# Altium schematic sheet PowerInput.SchDoc
size A4; SheetNumber: 2; SheetTotal: 7
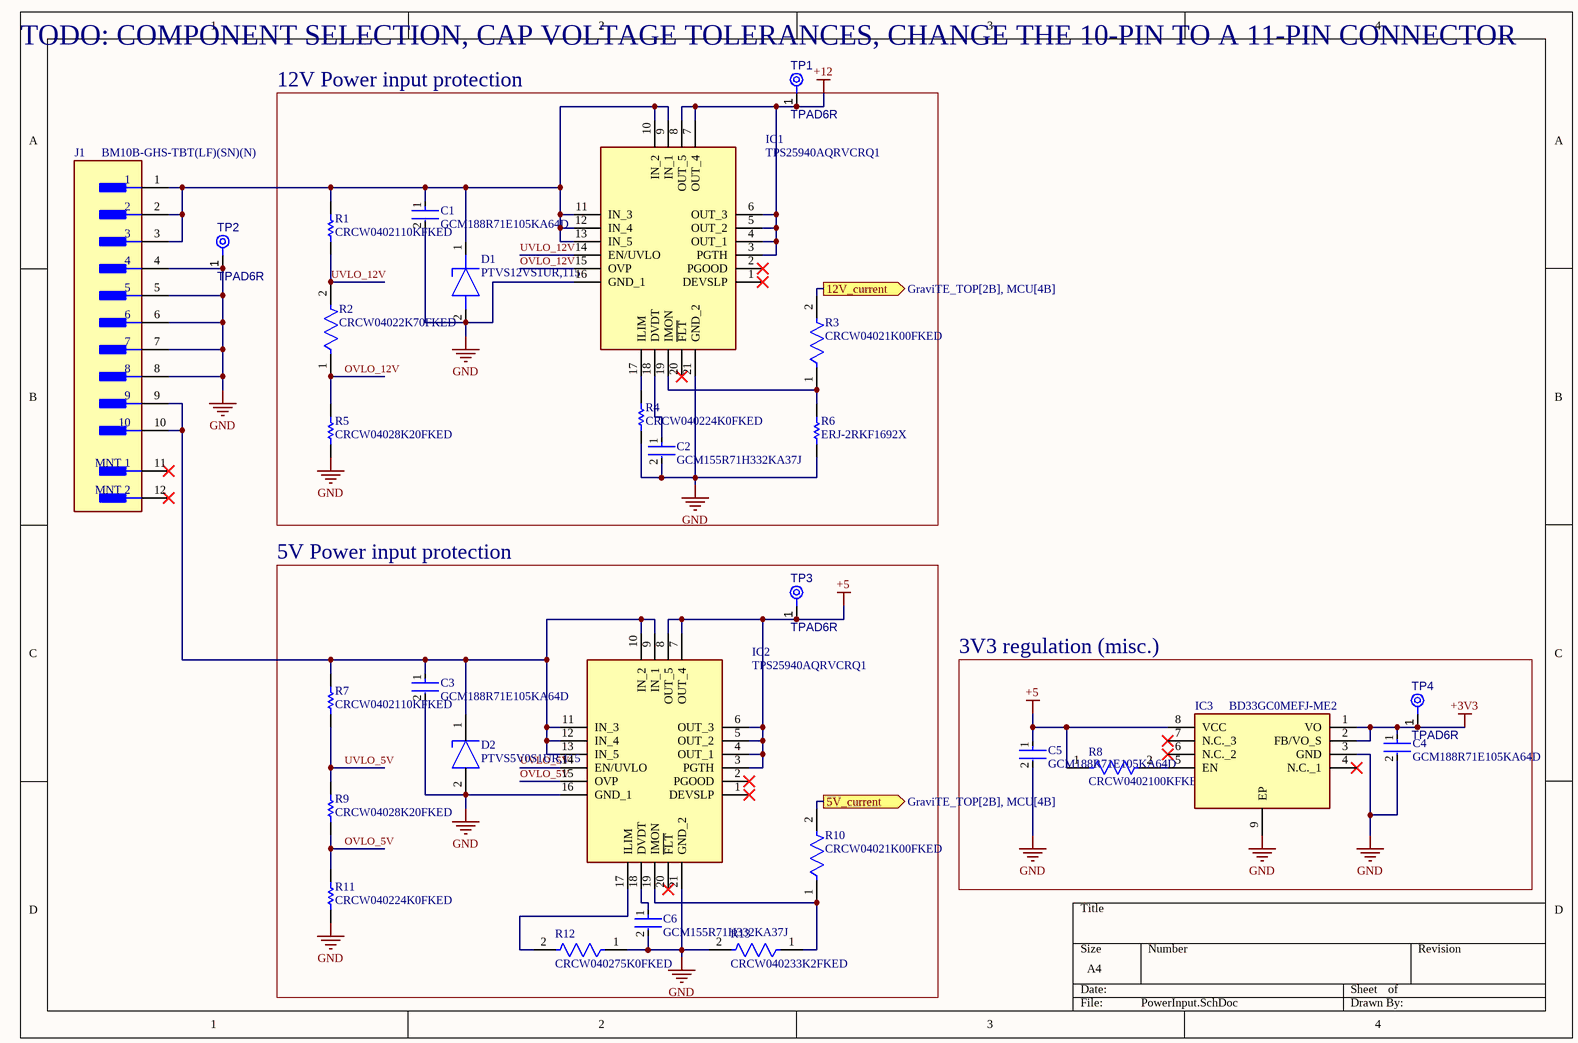
[diagram p0: PowerInput.SchDoc]

## Parts
C1  GCM188R71E105KA64D  [FP-GCM188-0_1-MFG]
C2  GCM155R71H332KA37J  [FP-GCM155-0_05-MFG]
C3  GCM188R71E105KA64D  [FP-GCM188-0_1-MFG]
C4  GCM188R71E105KA64D  [FP-GCM188-0_1-MFG]
C5  GCM188R71E105KA64D  [FP-GCM188-0_1-MFG]
C6  GCM155R71H332KA37J  [FP-GCM155-0_05-MFG]
D1  PTVS12VS1UR,115  [SOD123W]
D2  PTVS5V0S1UR,115  [FP-SOD123W-MFG]
IC1  TPS25940AQRVCRQ1  [QFN50P300X400X80-21N]
IC2  TPS25940AQRVCRQ1  [QFN50P300X400X80-21N]
IC3  BD33GC0MEFJ-ME2  [SOIC127P600X100-9N]
J1  BM10B-GHS-TBT(LF)(SN)(N)  [FP-BM10B-GHS-TBT_LF_SN-MFG]
R1  CRCW0402110KFKED  [RESC1005X40X25NL05T05]
R2  CRCW04022K70FKED  [FP-CRCW0402-e3-IPC_A]
R3  CRCW04021K00FKED  [FP-CRCW0402-e3-MFG]
R4  CRCW040224K0FKED  [RESC1005X40X25ML05T05]
R5  CRCW04028K20FKED  [RESC1005X40X25ML05T05]
R6  ERJ-2RKF1692X  [RESC1005X40X25ML05T05]
R7  CRCW0402110KFKED  [RESC1005X40X25NL05T05]
R8  CRCW0402100KFKED  [FP-CRCW0402-e3-IPC_C]
R9  CRCW04028K20FKED  [RESC1005X40X25ML05T05]
R10  CRCW04021K00FKED  [FP-CRCW0402-e3-MFG]
R11  CRCW040224K0FKED  [RESC1005X40X25ML05T05]
R12  CRCW040275K0FKED  [FP-CRCW0402-e3-IPC_A]
R13  CRCW040233K2FKED  [Vishay_CRCW0402-e3_MFG]
TP1  TPAD6R  [TP06R]  (no BOM)
TP2  TPAD6R  [TP06R]  (no BOM)
TP3  TPAD6R  [TP06R]  (no BOM)
TP4  TPAD6R  [TP06R]  (no BOM)

## Blocks framed on the sheet
12V Power input protection: C1 C2 D1 IC1 R1-R6
5V Power input protection: C3 C6 D2 IC2 R7 R9-R13 TP3
3V3 regulation (misc.): C4 C5 IC3 R8 TP4

## Ports
5V_current (out, see GraviTE_TOP[2B], MCU[4B]), 12V_current (out, see GraviTE_TOP[2B], MCU[4B])

## Nets
+3V3: C4.1 IC3.1(VO) IC3.2(FB/VO_S) TP4.1(TP)
+5: C5.1 IC2.3(PGTH) IC2.4(OUT_1) IC2.5(OUT_2) IC2.6(OUT_3) IC2.7(OUT_4) IC2.8(OUT_5) IC3.8(VCC) R8.1 TP3.1(TP)
+12: IC1.3(PGTH) IC1.4(OUT_1) IC1.5(OUT_2) IC1.6(OUT_3) IC1.7(OUT_4) IC1.8(OUT_5) TP1.1(TP)
GND: C1.2 C2.2 C3.2 C4.2 C5.2 C6.2 D1.2(A) D2.2(A) IC1.16(GND_1) IC1.21(GND_2) IC2.16(GND_1) IC2.21(GND_2) IC3.3(GND) IC3.9(EP) J1.4 J1.5 J1.6 J1.7 J1.8 R4.1 R5.1 R6.1 R11.1 R12.1 R13.2 TP2.1(TP)
5V_current: R10.2 ; port 5V_current
12V_current: R3.2 ; port 12V_current
OVLO_5V: IC2.15(OVP) R9.1 R11.2
OVLO_12V: IC1.15(OVP) R2.1 R5.2
UVLO_5V: IC2.14(EN/UVLO) R7.1 R9.2
UVLO_12V: IC1.14(EN/UVLO) R1.1 R2.2
NetC1_1: C1.1 D1.1(K) IC1.9(IN_1) IC1.10(IN_2) IC1.11(IN_3) IC1.12(IN_4) IC1.13(IN_5) J1.1 J1.2 J1.3 R1.2
NetC2_1: C2.1 IC1.18(DVDT)
NetC3_1: C3.1 D2.1(C) IC2.9(IN_1) IC2.10(IN_2) IC2.11(IN_3) IC2.12(IN_4) IC2.13(IN_5) J1.9 J1.10 R7.2
NetC6_1: C6.1 IC2.18(DVDT)
NetIC1_17: IC1.17(ILIM) R4.2
NetIC1_19: IC1.19(IMON) R3.1 R6.2
NetIC2_17: IC2.17(ILIM) R12.2
NetIC2_19: IC2.19(IMON) R10.1 R13.1
NetIC3_5: IC3.5(EN) R8.2

Not connected (* = marked no-connect by the designer): IC1 1(DEVSLP)* 2(PGOOD)* 20(~{FLT})*; IC2 1(DEVSLP)* 2(PGOOD)* 20(~{FLT})*; IC3 4(N.C._1)* 6(N.C._2)* 7(N.C._3)*; J1 11(MNT_1)* 12(MNT_2)*

## Notes on the sheet
- (near TP1) TODO: COMPONENT SELECTION, CAP VOLTAGE TOLERANCES, CHANGE THE 10-PIN TO A 11-PIN CONNECTOR

## Library data of the parts
C1 C3-C5 = CMP-2006-02363-4: Manufacturer Lifecycle Status: IN PRODUCTION; NexarPartId: 18909256; Dielectric: X7R; Material: Ceramic; Tolerance: 10%; Capacitance: 1µF; Voltage Rating: 25V; Thickness: 889µm; Max Operating Temperature: 125°C; Radiation Hardening: No; Weight: 6.293594mg; Lead Free: Lead Free; Mount: Surface Mount; Case Code (Imperial): 0603; REACH SVHC: No SVHC; Lifecycle Status: Production; Depth: 800µm; Min Operating Temperature: -55°C; Height: 800µm; Case Code (Metric): 1608; Case/Package: 0603; Voltage: 25V; Packaging: Cut Tape; Length: 1.6mm; Termination: SMD/SMT; Width: 787.4µm; Voltage Rating (DC): 25V; RoHS: Compliant; Schedule B: 8532240020, 8532240020; Ratings: AEC-Q200
C2 C6 = CMP-06035-006656-1: Ceramic Capacitor for Automotive 3.3nF ±10% 50VDC X7R 0402 Paper T/R; Voltage Rating (DC): 50V; Max Operating Temperature: 125°C; Termination: SMD/SMT; Depth: 0.5mm; Min Operating Temperature: -55°C; Voltage Rating: 50V; Length: 1mm; Radiation Hardening: No; Tolerance: 10%; Case Code (Imperial): 0402; Mount: Surface Mount; Package Quantity: 50000; Width: 0.5mm; Height: 0.5mm; Case Code (Metric): 1005; Capacitance: 3.3nF; Packaging: Tape and Reel; Case/Package: 0402; Dielectric: X7R
D1 = PTVS12VS1UR,115: Diode ESD (Uni-directional); Manufacturer_Name: Nexperia; Datasheet Link: https://assets.nexperia.com/documents/data-sheet/PTVSXS1UR_SER.pdf; Manufacturer_Part_Number: PTVS12VS1UR,115; Mouser Part Number: 771-PTVS12VS1UR115; Mouser Price/Stock: https://www.mouser.co.uk/ProductDetail/Nexperia/PTVS12VS1UR115?qs=LMSg3oBIm%2FiWSHvsyxWiLg%3D%3D; Arrow Part Number: PTVS12VS1UR,115; Arrow Price/Stock: https://www.arrow.com/en/products/ptvs12vs1ur115/nexperia?region=nac
D2 = CMP-14436-000018-1: TVS DIODE 5VWM 9.2VC CFP3; RoHS Compliant: Yes
IC1 IC2 = TPS25940AQRVCRQ1: Integrated Circuit; Manufacturer_Name: Texas Instruments; Datasheet Link: http://www.ti.com/lit/gpn/tps25940-q1; Height: 0.8mm; Manufacturer_Part_Number: TPS25940AQRVCRQ1; Mouser Part Number: 595-TPS25940AQRVCRQ1; Mouser Price/Stock: https://www.mouser.co.uk/ProductDetail/Texas-Instruments/TPS25940AQRVCRQ1?qs=osPbIpHqQ9Uam0Tf4VM8lQ%3D%3D; Arrow Part Number: TPS25940AQRVCRQ1; Arrow Price/Stock: https://www.arrow.com/en/products/tps25940aqrvcrq1/texas-instruments
IC3 = BD33GC0MEFJ-ME2: Integrated Circuit; Manufacturer_Name: ROHM Semiconductor; Datasheet Link: https://www.mouser.cl/datasheet/2/348/bdxxgc0mefj-m-e-1874062.pdf; Height: 1mm; Manufacturer_Part_Number: BD33GC0MEFJ-ME2; Mouser Part Number: 755-BD33GC0MEFJ-ME2; Mouser Price/Stock: https://www.mouser.com/Search/Refine.aspx?Keyword=755-BD33GC0MEFJ-ME2
J1 = CMP-17439-000269-1: CONN HEADER SMD 10POS 1.25MM; Mated Stacking Heights: 7.3mm; Number of Positions: 10; Voltage Rating: 50V; Packaging: Cut Tape; Contact Shape: Rectangular; Insulation Material: Nylon; Contact Type: Outer Shroud Contact; Contact Finish - Mating: TIN; Fastening Type: Ramp; Termination: Solder; Max Operating Temperature: 85°C; Min Operating Temperature: -25°C; Insulation Color: Natural; Number of Rows: 1; Flammability Rating: UL94 V-0; Contact Material: Bronze; Mount: Surface Mount; Series: GH; Connector Type: Header
R1 R7 = CMP-2002-08148-1: Manufacturer: Vishay Dale; Part Number: CRCW0402110KFKED
R2 = CMP-2002-08466-2: RES Thick Film, 2.7kΩ, 1%, 0.063W, 100ppm/°C, 0402; Power Rating: 63mW; Voltage Rating (DC): 50V; Resistance: 2.7kR; Termination: SMD/SMT; Composition: Thick Film; Packaging: Tape and Reel; Tolerance: 1%; Number of Pins: 2; Contact Plating: Tin; Max Operating Temperature: 155°C; Depth: 0.5mm; Features: Automotive AEC-Q200; Lead Free: Lead Free; Number of Terminations: 2; Case/Package: 0402; Max Power Dissipation: 63mW; Radiation Hardening: No; Height: 0.35mm; Min Operating Temperature: -55°C; Width: 0.02inch; Military Standard: Not; Package Quantity: 10; Weight: 2.3E-05oz; Temperature Coefficient: 100ppm/°C; Case Code (Metric): 1005; Voltage Rating: 50V; Length: 1mm; Case Code (Imperial): 0402
R3 R10 = CMP-2002-08276-2: RES Thick Film, 1kΩ, 1%, 0.063W, 100ppm/°C, 0402; Resistance: 1kR; Power Rating: 63mW; Voltage Rating (DC): 50V; Package Quantity: 10; Termination: SMD/SMT; Width: 0.5mm; Military Standard: Not; Length: 1mm; Contact Plating: Tin; Mount: Surface Mount; Packaging: Tape and Reel; Case Code (Imperial): 0402; Tolerance: 1%; Weight: 2.3E-05oz; Number of Pins: 2; Case/Package: 0402; Case Code (Metric): 1005; Lead Free: Lead Free; Number of Terminations: 2; Max Power Dissipation: 63mW; Depth: 0.5mm; Temperature Coefficient: 100ppm/°C; Max Operating Temperature: 155°C; Height: 0.35mm; Features: Automotive AEC-Q200; Composition: Thick Film; Radiation Hardening: No; Voltage Rating: 50V; Min Operating Temperature: -55°C
R4 R11 = CMP-2002-08403-1: Manufacturer: Vishay Dale; Part Number: CRCW040224K0FKED
R5 R9 = CMP-2002-00254-1: Manufacturer: Vishay Dale; Part Number: CRCW04028K20FKED
R6 = CMP-1011-00647-2: Manufacturer: Panasonic; Part Number: ERJ-2RKF1692X
R8 = CMP-2002-08123-3: RES Thick Film, 100kΩ, 1%, 0.063W, 100ppm/°C, 0402; Power Rating: 63mW; Resistance: 100kR; Voltage Rating (DC): 50V; Lead Free: Lead Free; Height: 0.35mm; Contact Plating: Tin; Min Operating Temperature: -55°C; Package Quantity: 10000; Case/Package: 0402; Temperature Coefficient: 100ppm/°C; Number of Terminations: 2; Packaging: Tape and Reel; Max Power Dissipation: 63mW; Case Code (Metric): 1005; Mount: Surface Mount; Width: 0.02inch; Termination: SMD/SMT; Length: 1mm; Number of Pins: 2; Weight: 2.3E-05oz; Radiation Hardening: No; Tolerance: 1%; Military Standard: Not; Features: Automotive AEC-Q200; Depth: 0.5mm; Composition: Thick Film; Max Operating Temperature: 155°C; Voltage Rating: 50V; Case Code (Imperial): 0402
R12 = CMP-2002-00208-2: RES Thick Film, 75kΩ, 1%, 0.063W, 100ppm/°C, 0402; Voltage Rating (DC): 50V; Max Power Dissipation: 63mW; Resistance: 75kR; Packaging: Tape and Reel; Radiation Hardening: No; Features: Automotive AEC-Q200; Depth: 0.5mm; Number of Pins: 2; Case/Package: 0402; Weight: 2.3E-05oz; Width: 0.02inch; Height: 0.35mm; Termination: SMD/SMT; Lead Free: Lead Free; Voltage Rating: 50V; Min Operating Temperature: -55°C; Package Quantity: 10; Case Code (Imperial): 0402; Composition: Thick Film; Contact Plating: Tin; Mount: Surface Mount; Tolerance: 1%; Case Code (Metric): 1005; Max Operating Temperature: 155°C; Temperature Coefficient: 100ppm/°C; Number of Terminations: 2; Military Standard: Not; Length: 1mm; Power Rating: 63mW
R13 = CMP-2002-08529-2: NexarPartId: 39869749; Power Rating: 63mW; Temperature Coefficient: 100ppm/°C; Resistance: 33.2kΩ; Voltage Rating: 50V; Tolerance: 1%; REACH SVHC: Unknown; Number of Pins: 2; Military Standard: Not; Composition: Thick Film; Case Code (Imperial): 0402; Number of Terminations: 2; Lead Free: Lead Free; Case Code (Metric): 1005; Termination: SMD/SMT; Case/Package: 0402; Contact Plating: Tin; Height: 350µm; Min Operating Temperature: -55°C; Mount: Surface Mount; Max Operating Temperature: 155°C; Features: Automotive AEC-Q200; Length: 1mm; Weight: 652.039032µg; Packaging: Cut Tape; Schedule B: 8533210045, 8533210045; Voltage Rating (DC): 50V; Depth: 500µm; Max Power Dissipation: 63mW; RoHS: Compliant; Radiation Hardening: No; Width: 500µm
TP1-TP4 = CMP-00028-00002-2: 0.6mm round; Pins: 1